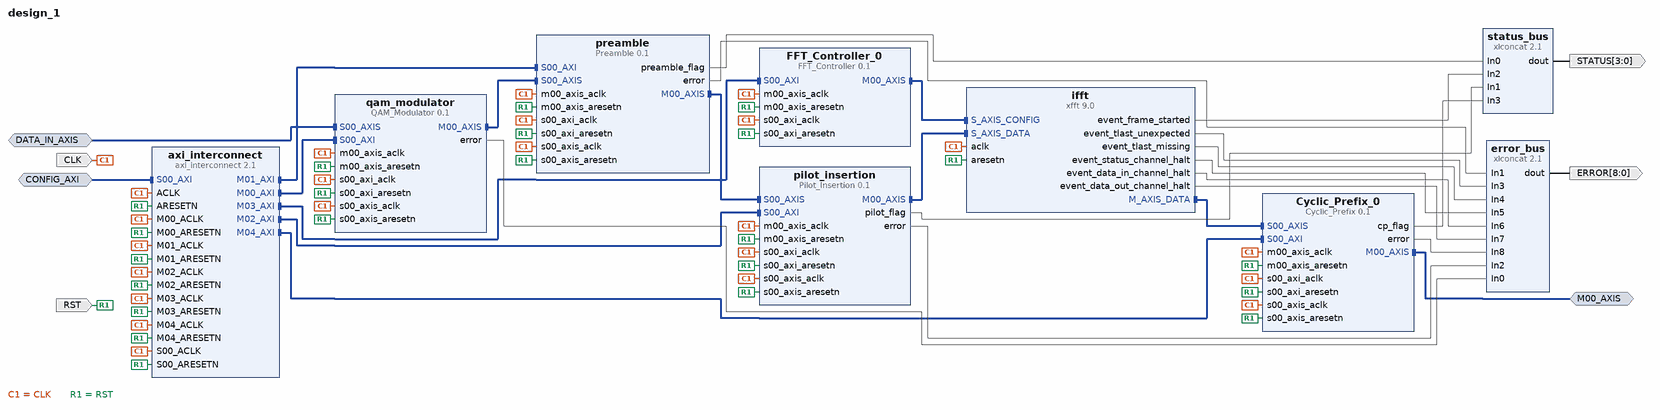
[diagram p0: block diagram of the top level]
# Vivado block design design_1, xc7z020clg484-1, Vivado 2016.4
create_bd_design design_1

create_bd_intf_port -mode Slave -vlnv xilinx.com:interface:axis_rtl:1.0 DATA_IN_AXIS
set_property -dict [list \
  CONFIG.TDATA_NUM_BYTES 4 \
  CONFIG.TDEST_WIDTH 0 \
  CONFIG.TID_WIDTH 0 \
  CONFIG.TUSER_WIDTH 0 \
  CONFIG.HAS_TREADY 1 \
  CONFIG.HAS_TSTRB 1 \
  CONFIG.HAS_TKEEP 0 \
  CONFIG.HAS_TLAST 1 \
  CONFIG.LAYERED_METADATA undef \
] [get_bd_intf_ports DATA_IN_AXIS]
create_bd_intf_port -mode Slave -vlnv xilinx.com:interface:aximm_rtl:1.0 CONFIG_AXI
set_property -dict [list \
  CONFIG.DATA_WIDTH 32 \
  CONFIG.PROTOCOL AXI4LITE \
  CONFIG.FREQ_HZ 100000000 \
  CONFIG.ID_WIDTH 0 \
  CONFIG.ADDR_WIDTH 15 \
  CONFIG.AWUSER_WIDTH 0 \
  CONFIG.ARUSER_WIDTH 0 \
  CONFIG.WUSER_WIDTH 0 \
  CONFIG.RUSER_WIDTH 0 \
  CONFIG.BUSER_WIDTH 0 \
  CONFIG.READ_WRITE_MODE READ_WRITE \
  CONFIG.HAS_BURST 0 \
  CONFIG.HAS_LOCK 0 \
  CONFIG.HAS_PROT 1 \
  CONFIG.HAS_CACHE 0 \
  CONFIG.HAS_QOS 0 \
  CONFIG.HAS_REGION 0 \
  CONFIG.HAS_WSTRB 1 \
  CONFIG.HAS_BRESP 1 \
  CONFIG.HAS_RRESP 1 \
  CONFIG.SUPPORTS_NARROW_BURST 0 \
  CONFIG.NUM_READ_OUTSTANDING 1 \
  CONFIG.NUM_WRITE_OUTSTANDING 1 \
  CONFIG.MAX_BURST_LENGTH 1 \
  CONFIG.NUM_READ_THREADS 1 \
  CONFIG.NUM_WRITE_THREADS 1 \
  CONFIG.RUSER_BITS_PER_BYTE 0 \
  CONFIG.WUSER_BITS_PER_BYTE 0 \
] [get_bd_intf_ports CONFIG_AXI]
create_bd_intf_port -mode Master -vlnv xilinx.com:interface:axis_rtl:1.0 M00_AXIS
create_bd_port -dir O -from 3 -to 0 -type data STATUS
create_bd_port -dir O -from 8 -to 0 -type data ERROR
create_bd_port -dir I -type clk CLK
set_property -dict {CONFIG.FREQ_HZ 100000000} [get_bd_ports CLK]
create_bd_port -dir I RST

create_bd_cell -type ip -vlnv xilinx.com:ip:xfft:9.0 ifft
set_property -dict [list \
  CONFIG.run_time_configurable_transform_length true \
  CONFIG.aresetn true \
  CONFIG.memory_options_data block_ram \
] [get_bd_cells ifft]
create_bd_cell -type ip -vlnv xilinx.com:ip:xlconcat:2.1 error_bus
set_property -dict {CONFIG.NUM_PORTS 9} [get_bd_cells error_bus]
create_bd_cell -type ip -vlnv xilinx.com:ip:xlconcat:2.1 status_bus
set_property -dict {CONFIG.NUM_PORTS 4} [get_bd_cells status_bus]
create_bd_cell -type ip -vlnv xilinx.com:ip:axi_interconnect:2.1 axi_interconnect
set_property -dict {CONFIG.NUM_MI 5} [get_bd_cells axi_interconnect]
create_bd_cell -type ip -vlnv user.org:user:QAM_Modulator:0.1 qam_modulator
create_bd_cell -type ip -vlnv user.org:user:Pilot_Insertion:0.1 pilot_insertion
create_bd_cell -type ip -vlnv user.org:user:Preamble:0.1 preamble
create_bd_cell -type ip -vlnv user.org:user:Cyclic_Prefix:0.1 Cyclic_Prefix_0
create_bd_cell -type ip -vlnv user.org:user:FFT_Controller:0.1 FFT_Controller_0

# ---- connections ----

connect_bd_intf_net -intf_net Pilot_Insertion_0_M00_AXIS [get_bd_intf_pins pilot_insertion/M00_AXIS] [get_bd_intf_pins ifft/S_AXIS_DATA]
connect_bd_intf_net -intf_net Preamble_0_M00_AXIS [get_bd_intf_pins preamble/M00_AXIS] [get_bd_intf_pins pilot_insertion/S00_AXIS]
connect_bd_intf_net [get_bd_intf_pins preamble/S00_AXIS] [get_bd_intf_pins qam_modulator/M00_AXIS]
connect_bd_intf_net -intf_net axi_interconnect_0_M00_AXI [get_bd_intf_pins axi_interconnect/M00_AXI] [get_bd_intf_pins qam_modulator/S00_AXI]
connect_bd_intf_net -intf_net axi_interconnect_0_M01_AXI [get_bd_intf_pins preamble/S00_AXI] [get_bd_intf_pins axi_interconnect/M01_AXI]
connect_bd_intf_net -intf_net axi_interconnect_0_M02_AXI [get_bd_intf_pins pilot_insertion/S00_AXI] [get_bd_intf_pins axi_interconnect/M02_AXI]
connect_bd_intf_net [get_bd_intf_pins Cyclic_Prefix_0/S00_AXIS] [get_bd_intf_pins ifft/M_AXIS_DATA]
connect_bd_intf_net [get_bd_intf_pins Cyclic_Prefix_0/S00_AXI] [get_bd_intf_pins axi_interconnect/M04_AXI]
connect_bd_intf_net [get_bd_intf_pins FFT_Controller_0/M00_AXIS] [get_bd_intf_pins ifft/S_AXIS_CONFIG]
connect_bd_intf_net [get_bd_intf_pins FFT_Controller_0/S00_AXI] [get_bd_intf_pins axi_interconnect/M03_AXI]
connect_bd_intf_net [get_bd_intf_ports DATA_IN_AXIS] [get_bd_intf_pins qam_modulator/S00_AXIS]
connect_bd_intf_net [get_bd_intf_ports CONFIG_AXI] [get_bd_intf_pins axi_interconnect/S00_AXI]
connect_bd_intf_net [get_bd_intf_ports M00_AXIS] [get_bd_intf_pins Cyclic_Prefix_0/M00_AXIS]
connect_bd_net -net QAM_Modulator_0_error [get_bd_pins qam_modulator/error] [get_bd_pins error_bus/In0]
connect_bd_net -net xfft_0_event_tlast_unexpected [get_bd_pins ifft/event_tlast_unexpected] [get_bd_pins error_bus/In3]
connect_bd_net -net xfft_0_event_tlast_missing [get_bd_pins ifft/event_tlast_missing] [get_bd_pins error_bus/In4]
connect_bd_net -net xfft_0_event_status_channel_halt [get_bd_pins ifft/event_status_channel_halt] [get_bd_pins error_bus/In5]
connect_bd_net -net xfft_0_event_data_in_channel_halt [get_bd_pins ifft/event_data_in_channel_halt] [get_bd_pins error_bus/In6]
connect_bd_net -net xfft_0_event_data_out_channel_halt [get_bd_pins ifft/event_data_out_channel_halt] [get_bd_pins error_bus/In7]
connect_bd_net [get_bd_pins pilot_insertion/error] [get_bd_pins error_bus/In2]
connect_bd_net -net Preamble_0_error [get_bd_pins preamble/error] [get_bd_pins error_bus/In1]
connect_bd_net [get_bd_pins preamble/preamble_flag] [get_bd_pins status_bus/In0]
connect_bd_net [get_bd_pins pilot_insertion/pilot_flag] [get_bd_pins status_bus/In1]
connect_bd_net [get_bd_pins ifft/event_frame_started] [get_bd_pins status_bus/In2]
connect_bd_net [get_bd_pins status_bus/dout] [get_bd_ports STATUS]
connect_bd_net [get_bd_pins error_bus/dout] [get_bd_ports ERROR]
connect_bd_net -net processing_system7_0_FCLK_CLK0 [get_bd_ports CLK] \
  [get_bd_pins ifft/aclk] [get_bd_pins qam_modulator/s00_axi_aclk] [get_bd_pins qam_modulator/s00_axis_aclk] \
  [get_bd_pins qam_modulator/m00_axis_aclk] [get_bd_pins pilot_insertion/m00_axis_aclk] \
  [get_bd_pins pilot_insertion/s00_axis_aclk] [get_bd_pins pilot_insertion/s00_axi_aclk] [get_bd_pins preamble/m00_axis_aclk] \
  [get_bd_pins preamble/s00_axis_aclk] [get_bd_pins preamble/s00_axi_aclk] [get_bd_pins Cyclic_Prefix_0/s00_axi_aclk] \
  [get_bd_pins Cyclic_Prefix_0/s00_axis_aclk] [get_bd_pins Cyclic_Prefix_0/m00_axis_aclk] \
  [get_bd_pins FFT_Controller_0/s00_axi_aclk] [get_bd_pins FFT_Controller_0/m00_axis_aclk] \
  [get_bd_pins axi_interconnect/ACLK] [get_bd_pins axi_interconnect/S00_ACLK] [get_bd_pins axi_interconnect/M00_ACLK] \
  [get_bd_pins axi_interconnect/M01_ACLK] [get_bd_pins axi_interconnect/M02_ACLK] [get_bd_pins axi_interconnect/M03_ACLK] \
  [get_bd_pins axi_interconnect/M04_ACLK]
connect_bd_net [get_bd_ports RST] \
  [get_bd_pins ifft/aresetn] [get_bd_pins qam_modulator/s00_axi_aresetn] [get_bd_pins qam_modulator/s00_axis_aresetn] \
  [get_bd_pins qam_modulator/m00_axis_aresetn] [get_bd_pins pilot_insertion/m00_axis_aresetn] \
  [get_bd_pins pilot_insertion/s00_axis_aresetn] [get_bd_pins pilot_insertion/s00_axi_aresetn] \
  [get_bd_pins preamble/m00_axis_aresetn] [get_bd_pins preamble/s00_axis_aresetn] [get_bd_pins preamble/s00_axi_aresetn] \
  [get_bd_pins Cyclic_Prefix_0/s00_axi_aresetn] [get_bd_pins Cyclic_Prefix_0/s00_axis_aresetn] \
  [get_bd_pins Cyclic_Prefix_0/m00_axis_aresetn] [get_bd_pins FFT_Controller_0/s00_axi_aresetn] \
  [get_bd_pins FFT_Controller_0/m00_axis_aresetn] [get_bd_pins axi_interconnect/ARESETN] \
  [get_bd_pins axi_interconnect/M01_ARESETN] [get_bd_pins axi_interconnect/M00_ARESETN] \
  [get_bd_pins axi_interconnect/S00_ARESETN] [get_bd_pins axi_interconnect/M02_ARESETN] \
  [get_bd_pins axi_interconnect/M03_ARESETN] [get_bd_pins axi_interconnect/M04_ARESETN]
connect_bd_net [get_bd_pins Cyclic_Prefix_0/cp_flag] [get_bd_pins status_bus/In3]
connect_bd_net [get_bd_pins Cyclic_Prefix_0/error] [get_bd_pins error_bus/In8]

# ---- address map ----
assign_bd_address -offset 0x0000 -range 4K -target_address_space [get_bd_addr_spaces CONFIG_AXI] [get_bd_addr_segs FFT_Controller_0/S00_AXI/S00_AXI_reg]
assign_bd_address -offset 0x1000 -range 4K -target_address_space [get_bd_addr_spaces CONFIG_AXI] [get_bd_addr_segs Cyclic_Prefix_0/S00_AXI/S00_AXI_reg]
assign_bd_address -offset 0x2000 -range 4K -target_address_space [get_bd_addr_spaces CONFIG_AXI] [get_bd_addr_segs pilot_insertion/S00_AXI/S00_AXI_reg]
assign_bd_address -offset 0x3000 -range 4K -target_address_space [get_bd_addr_spaces CONFIG_AXI] [get_bd_addr_segs preamble/S00_AXI/S00_AXI_reg]
assign_bd_address -offset 0x4000 -range 4K -target_address_space [get_bd_addr_spaces CONFIG_AXI] [get_bd_addr_segs qam_modulator/S00_AXI/S00_AXI_reg]

validate_bd_design
save_bd_design
